# EAGLE schematic TK-BB-MD-07_vb (EAGLE 9.5.2)
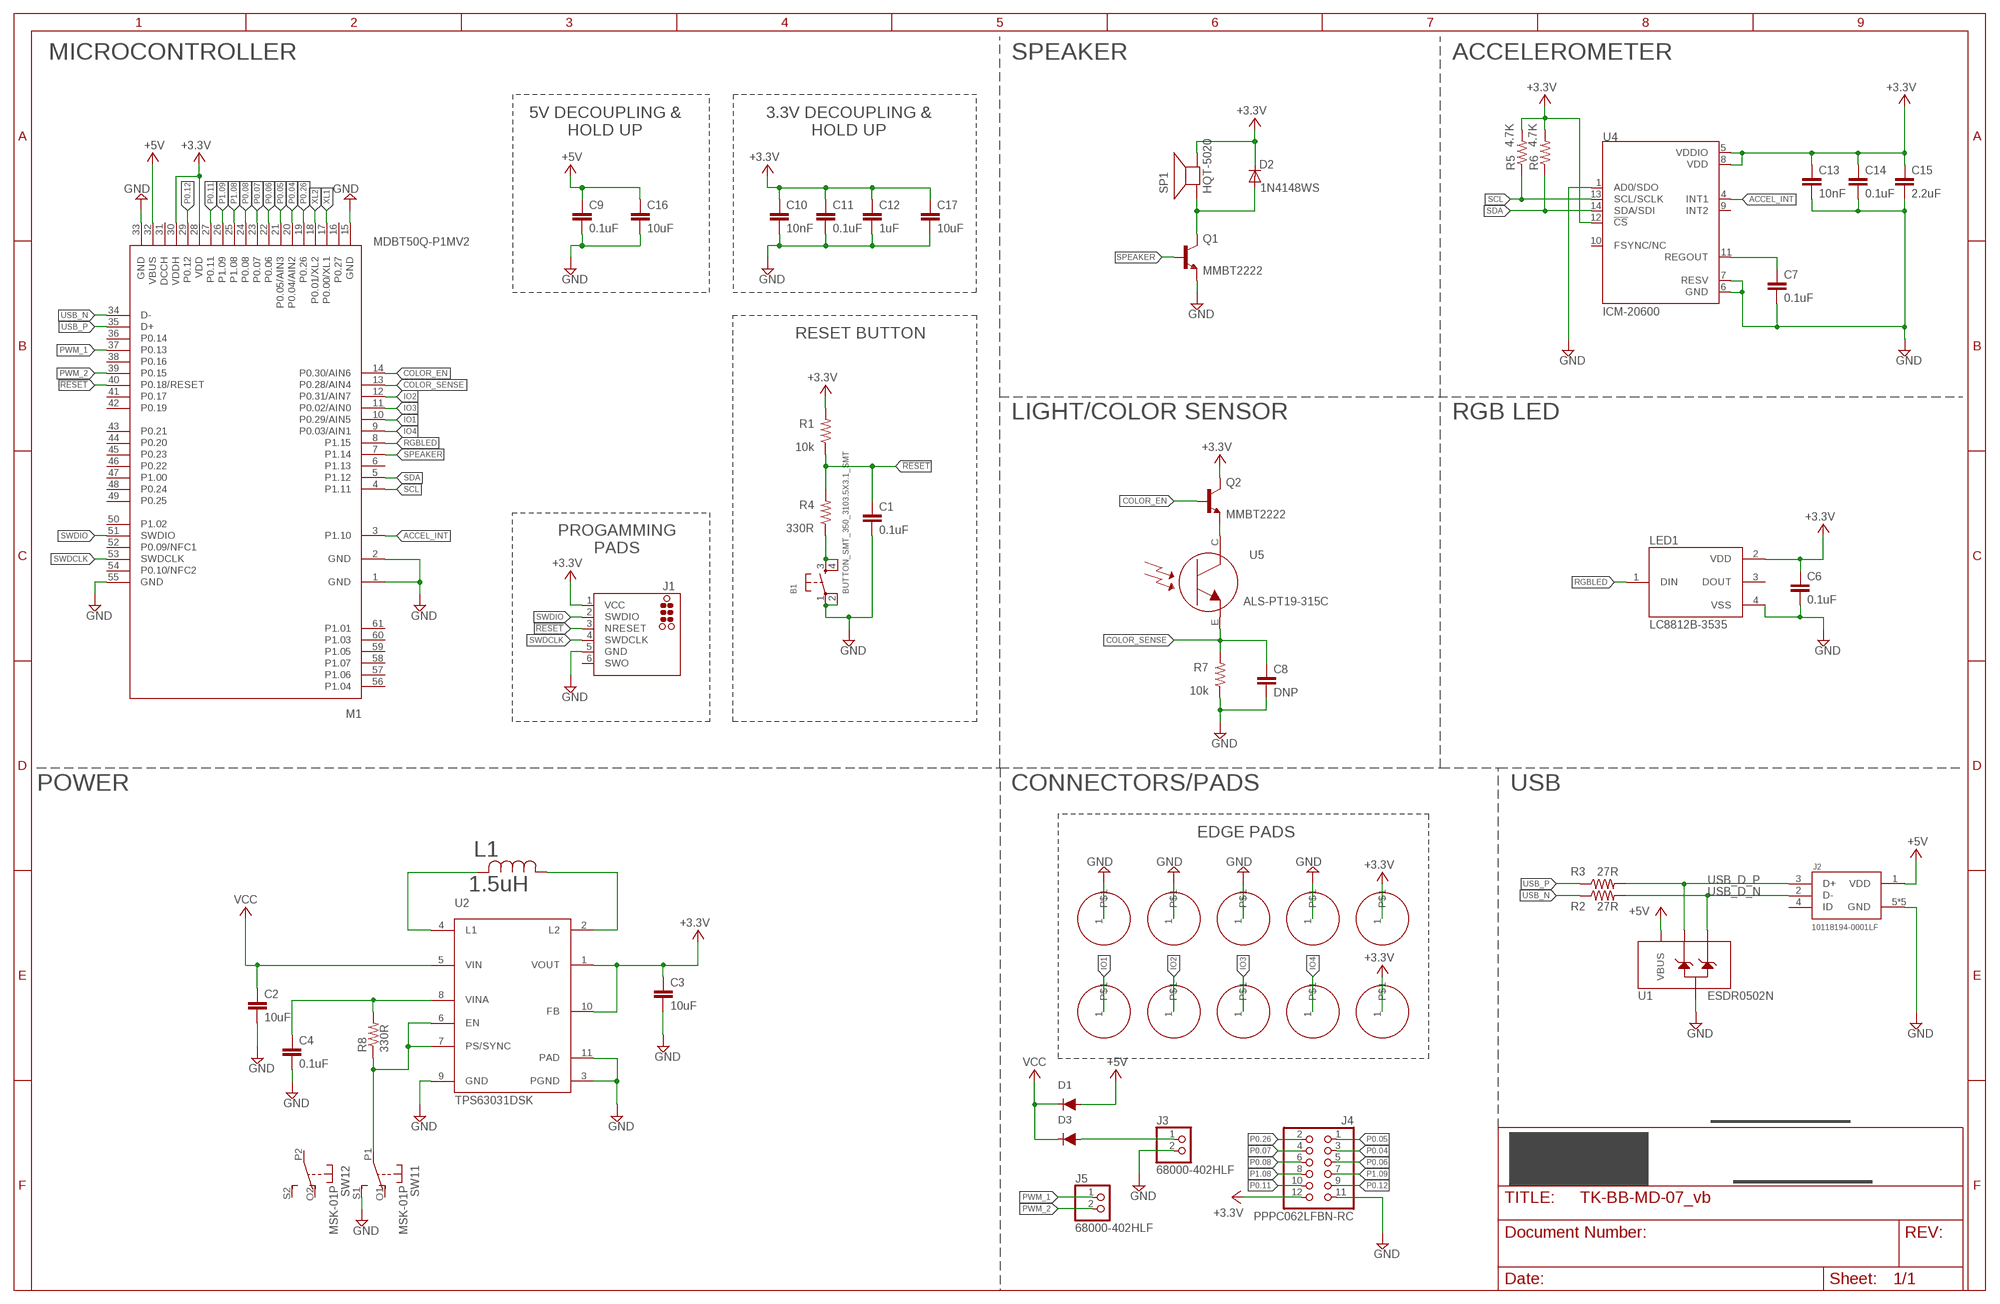
[diagram p0: schematic, sheet 1]

## Parts
B1  BUTTON_SMT_350_3103.5X3.1_SMT  [3.5X3.1_SMT]
C1  0.1uF  C_0.1UF_10V_0402  [0402]
C2  10uF  C_10UF_10V_0402  [0402]
C3  10uF  C_10UF_10V_0402  [0402]
C4  0.1uF  C_0.1UF_10V_0402  [0402]
C6  0.1uF  C_0.1UF_10V_0402  [0402]
C7  0.1uF  C_0.1UF_10V_0402  [0402]
C8  DNP  C_DNP_0402  [0402]
C9  0.1uF  C_0.1UF_10V_0402  [0402]
C10  10nF  C_10NF_10V_0402  [0402]
C11  0.1uF  C_0.1UF_10V_0402  [0402]
C12  1uF  C_1UF_10V_0402  [0402]
C13  10nF  C_10NF_10V_0402  [0402]
C14  0.1uF  C_0.1UF_10V_0402  [0402]
C15  2.2uF  C_2.2UF_10V_0402  [0402]
C16  10uF  C_10UF_10V_0402  [0402]
C17  10uF  C_10UF_10V_0402  [0402]
D1  NSR0320MW2T1G  DIODE_SCHOTTKY_NSR0320MW2T1G  [SOD323]
D2  1N4148WS  DIODE_1N148WSSOD-323  [SOD-323]
D3  NSR0320MW2T1G  DIODE_SCHOTTKY_NSR0320MW2T1G  [SOD323]
J1  DNP  TC2030-MCP-NL  [TC2030-MCP-NL]
J2  10118194-0001LF  [10118194-0001LF]
J3  68000-402HLF  PINHD-1X2  [1X02]
J4  PPPC062LFBN-RC  PINHD-2X6-F  [2X06-F]
J5  68000-402HLF  PINHD-1X2  [1X02]
L1  1.5uH  SDEM25201T-1R5MS  [INDC250X200X100]
LED1  LC8812B-3535  SK6812MINI_LC8812B-3535  [LC8812B-3535]
M1  MDBT50Q-P1MV2  [MDBT50]
P1  BB_PADS_BANANA_ROUND  [BB_PAD_BANANA]
P2  BB_PADS_BANANA_ROUND  [BB_PAD_BANANA]
P3  BB_PADS_BANANA_ROUND  [BB_PAD_BANANA]
P4  BB_PADS_BANANA_ROUND  [BB_PAD_BANANA]
P5  BB_PADS_BANANA_ROUND  [BB_PAD_BANANA]
P6  BB_PADS_BANANA_ROUND  [BB_PAD_BANANA]
P7  BB_PADS_BANANA_ROUND  [BB_PAD_BANANA]
P8  BB_PADS_BANANA_ROUND  [BB_PAD_BANANA]
P9  BB_PADS_BANANA_ROUND  [BB_PAD_BANANA]
P10  BB_PADS_BANANA_ROUND  [BB_PAD_BANANA]
Q1  MMBT2222  TRANSISTOR_NPN_MMBT2222_WIDE  [SOT23-WIDE]
Q2  MMBT2222  TRANSISTOR_NPN_MMBT2222_WIDE  [SOT23-WIDE]
R1  10k  R_10K_0.0625W_0402  [0402]
R2  27R  R_27R_0.0625W_0402  [0402]
R3  27R  R_27R_0.0625W_0402  [0402]
R4  330R  R_330R_0.0625W_0402  [0402]
R5  4.7K  R_4.7K_0.0625W_0402  [0402]
R6  4.7K  R_4.7K_0.0625W_0402  [0402]
R7  10k  R_10K_0.1W_0402  [0402]
R8  330R  R_330R_0.0625W_0402  [0402]
SP1  HQT-5020  SPEAKER_HQT-5020  [HQT-5020]
SW1  MSK-01P  DPDT_MSK-01P  [MSK-01P]
U1  ESDR0502N  [6-UFDFN]
U2  TPS63031DSK  TPS63031DSKT  [SON11P50_250X250X80]
U4  ICM-20600  [ICM-20600]
U5  ALS-PT19-315C  [ALS-PT19-315C]

## Nets
!RESET: C1.1 J1.3(NRESET) M1.40(P0.18/RESET) R1.1 R4.2
+3.3V: C3.1 C6.1 C10.1 C11.1 C12.1 C13.1 C14.1 C15.1 C17.1 D2.C J1.1(VCC) J4.12 LED1.2(VDD) M1.28(VDD) M1.30(VDDH) P9.1 P10.1 Q2.3(C) R1.2 R5.2 R6.2 SP1.- U2.1(VOUT) U2.10(FB) U4.5(VDDIO) U4.8(VDD) U4.12(!CS)
+3V3_IN_HDR: D3.2(A) J3.1
+5V: C9.1 C16.1 D1.2(A) J2.1(VDD) M1.32(VBUS) U1.P$6(VBUS)
ACCEL_INT: M1.3(P1.10) U4.4(INT1)
ACCEL_REGOUT: C7.1 U4.11(REGOUT)
ALS_C: Q2.2(E) U5.C
COLOR_EN: M1.14(P0.30/AIN6) Q2.1(B)
COLOR_SENSE: C8.1 M1.13(P0.28/AIN4) R7.2 U5.E
GND: B1.1(P) B1.2(P1) C1.2 C2.2 C3.2 C4.2 C6.2 C7.2 C8.2 C9.2 C10.2 C11.2 C12.2 C13.2 C14.2 C15.2 C16.2 C17.2 J1.5(GND) J2.5(GND) J2.P$6(GND) J2.P$7(GND) J2.P$8(GND) J2.P$9(GND) J3.2 J4.11 LED1.4(VSS) M1.1(GND) M1.2(GND) M1.15(GND) M1.33(GND) M1.55(GND) P1.1 P2.1 P3.1 P8.1 Q1.2(E) R7.1 SW1.S1(1:S) U1.P$1(GND) U2.3(PGND) U2.9(GND) U2.11(PAD) U4.1(AD0/SDO) U4.6(GND) U4.7(RESV)
IO1: M1.10(P0.29/AIN5) P6.1
IO2: M1.12(P0.31/AIN7) P4.1
IO3: M1.11(P0.02/AIN0) P7.1
IO4: M1.9(P0.03/AIN1) P5.1
N$1: L1.2 U2.4(L1)
N$2: B1.3(S) B1.4(S1) R4.1
N$3: L1.1 U2.2(L2)
N$4: R8.1 SW1.P1(1:P) U2.6(EN) U2.7(PS/SYNC)
N$6: C4.1 R8.2 U2.8(VINA)
P0.04: J4.3 M1.20(P0.04/AIN2)
P0.05: J4.1 M1.21(P0.05/AIN3)
P0.06: J4.5 M1.22(P0.06)
P0.07: J4.4 M1.23(P0.07)
P0.08: J4.6 M1.24(P0.08)
P0.11: J4.10 M1.27(P0.11)
P0.12: J4.9 M1.29(P0.12)
P0.26: J4.2 M1.19(P0.26)
P1.08: J4.8 M1.25(P1.08)
P1.09: J4.7 M1.26(P1.09)
PWM_1: J5.1 M1.37(P0.13)
PWM_2: J5.2 M1.39(P0.15)
Q1_C: D2.A Q1.3(C) SP1.+
RGBLED: LED1.1(DIN) M1.8(P1.15)
SCL: M1.4(P1.11) R5.1 U4.13(SCL/SCLK)
SDA: M1.5(P1.12) R6.1 U4.14(SDA/SDI)
SPEAKER: M1.7(P1.14) Q1.1(B)
SWDCLK: J1.4(SWDCLK) M1.53(SWDCLK)
SWDIO: J1.2(SWDIO) M1.51(SWDIO)
USB_D_N [USB]: J2.2(D-) R2.2 U1.P$3(D-) U1.P$4(D-)
USB_D_P [USB]: J2.3(D+) R3.2 U1.P$2(D+) U1.P$5(D+)
USB_N [USB]: M1.34(D-) R2.1
USB_P [USB]: M1.35(D+) R3.1
VCC: C2.1 D1.1(C) D3.1(C) U2.5(VIN)
XL1: M1.17(P0.00/XL1)
XL2: M1.18(P0.01/XL2)
Unconnected: J1.6(SWO) J2.4(ID) LED1.3(DOUT) M1.6(P1.13) M1.16(P0.27) M1.31(DCCH) M1.36(P0.14) M1.38(P0.16) M1.41(P0.17) M1.42(P0.19) M1.43(P0.21) M1.44(P0.20) M1.45(P0.23) M1.46(P0.22) M1.47(P1.00) M1.48(P0.24) M1.49(P0.25) M1.50(P1.02) M1.52(P0.09/NFC1) M1.54(P0.10/NFC2) M1.56(P1.04) M1.57(P1.06) M1.58(P1.07) M1.59(P1.05) M1.60(P1.03) M1.61(P1.01) SW1.O1(1:O) SW1.O2(2:O) SW1.P2(2:P) SW1.S2(2:S) U4.9(INT2) U4.10(FSYNC/NC)

## Notes on the sheet
- MICROCONTROLLER | SPEAKER | ACCELEROMETER
- 5V DECOUPLING &
  HOLD UP
- 3.3V DECOUPLING &
  HOLD UP
- RESET BUTTON
- LIGHT/COLOR SENSOR | RGB LED
- PROGAMMING
  PADS
- POWER | CONNECTORS/PADS | USB
- EDGE PADS

## Library data of the parts
B1 = teknikio-button:BUTTON_SMT_350_310
C1 C4 C6 C7 C9 C11 C14 = teknikio-passives:C: Standard SMD chip capacitors; DESCRIPTION: CAP CER 0.1UF 10V X7R 0402; MANUFACTURER: Yageo; MANUFACTURER_PART_NUMBER: CC0402KRX7R6BB104; SUPPLIER: Digi-Key; SUPPLIER_PART_NUMBER: 311-1345-1-ND
C2 C3 C16 C17 = teknikio-passives:C: Standard SMD chip capacitors; DESCRIPTION: CAP CER 10UF 10V X5R 0402; MANUFACTURER: Samsung; MANUFACTURER_PART_NUMBER: CL05A106MP8NUB8; SUPPLIER: Digi-Key; SUPPLIER_PART_NUMBER: 1276-6830-1-ND
C8 = teknikio-passives:C: Standard SMD chip capacitors; DESCRIPTION: 0402 CAP; MANUFACTURER: N/A; MANUFACTURER_PART_NUMBER: N/A; SUPPLIER: N/A; SUPPLIER_PART_NUMBER: N/A
C10 C13 = teknikio-passives:C: Standard SMD chip capacitors; DESCRIPTION: CAP CER 10000PF 10V X7R 0402; MANUFACTURER: Yageo; MANUFACTURER_PART_NUMBER: C0402C103K8RACTU; SUPPLIER: Digi-Key; SUPPLIER_PART_NUMBER: 399-7759-1-ND
C12 = teknikio-passives:C: Standard SMD chip capacitors; DESCRIPTION: CAP CER 1UF 10V X5R 0402; MANUFACTURER: Yageo; MANUFACTURER_PART_NUMBER: CC0402KRX5R6BB105; SUPPLIER: Digi-Key; SUPPLIER_PART_NUMBER: 311-1439-1-ND
C15 = teknikio-passives:C: Standard SMD chip capacitors; DESCRIPTION: CAP CER 2.2UF 10V X5R 0402; MANUFACTURER: Taiyo Yuden; MANUFACTURER_PART_NUMBER: LMK105BJ225MV-F; SUPPLIER: Digi-Key; SUPPLIER_PART_NUMBER: 587-3153-1-ND
D1 D3 = teknikio-passives:DIODE_SCHOTTKY; DESCRIPTION: DIODE SCHOTTKY 20V 1A SOD323; MANUFACTURER: ON Semiconductor; MANUFACTURER_PART_NUMBER: NSR0320MW2T1G; SUPPLIER: Digi-Key; SUPPLIER_PART_NUMBER: NSR0320MW2T1GOSCT-ND
D2 = teknikio-passives:DIODE: Diode SMA Model Volts Amps Type Vf Ir Digikey # Notes SSA34-E3 40V 3A Schottky 480mV @ 3A 200uA @ 40V SSA34-E3/61TGITR-ND CDBA120-G 20V 1A Schottky 500mV @ 1A 500uA @ 20V 641-1014-6-ND REEL MBRA210 10V 2A Schottky 350mV @ 2A 700uA @ 10V MBRA210LT3 SOD-123 Model Volts Amps Type Vf Ir Order # Notes BAT54T1G 30V 200mA Schottky 800mV @ 200mA 2uA @ 25V BAT54T1GOSTR-ND B0530W 30V 500mA Schottky 430mV @ 500mA 130uA @ 30V B0530W-FDICT-ND REEL MBR120 20V 1A Schottky 340mV @ 1A MBR120VLSFT1GOSCT-ND SOD-323 Model Volts Amps Type Vf Ir Order # Notes PMEG2005EJ 20V 500mA Schottky 355mV @ 500mA 568-4110-1-ND ZLLS410 10V 570mA Schottky 380mV @ 570mA ZLLS410CT-ND 1N4148WS 75V 150mA Silicon/Simple 1V 1N4148WSFSCT-ND REEL SOD-523 Model Volts Amps Type Vf Ir Order # Notes BAT54XV2 30V 200mA Schottky 0.8V @ 100mA BAT54XV2CT-ND TB751S 30V 30mA Schottky RB751S-40TE61CT-ND SOT23-R/W (R = Solder Paste/Reflow Ovens, W = Hand-Soldering) Model Volts Amps Type Vf Ir Order # Notes BAT54FILM 40V 300mA Schottky 497-7162-1-ND POWERDI-5 Model Volts Amps Type Vf Ir Order # Notes PDS560 60V 5A Schottky 670mV @ 5A 150uA @ 60V PDS560DICT-ND; DESCRIPTION: DIODE GEN PURP 75V 150MA SOD323F; MANUFACTURER: ON Semiconductor; MANUFACTURER_PART_NUMBER: 1N4148WS; SUPPLIER: Digi-Key; SUPPLIER_PART_NUMBER: 1N4148WSFSCT-ND
J1 = teknikio-conn:TC2030: TAG-CONNECT ICSP Connector Manufacturer: Tag-Connect <http://www.tag-connect.com> Cable for easy In-Circuit Serial Programming. Designed for Microchip ICD2, suitable for many others. Two variants - one "with legs" (for hands-free fit on PCB) and another "without legs" for quick programming. PAD Description 1 MCLR/Vpp 2 Vdd 3 GND 4 PGD (ISPDAT) 5 PGC (ISPCLK) 6 nc (used for LVP) ©2009 ROFA.cz - modified and updated by Robert Darlington ‹rdarlington@gmail.com›; DESCRIPTION: Tag-Connect ICSP Header - No Legs; MANUFACTURER: N/A; MANUFACTURER_PART_NUMBER: N/A; SUPPLIER: N/A; SUPPLIER_PART_NUMBER: N/A
J2 = teknikio-conn:10118194-0001LF: Conn Micro USB Type B RCP 5 POS 0.65mm Solder RA SMD 5 Terminal 1 Port T/R; DESCRIPTION: Conn Micro USB Type B RCP 5 POS 0.65mm Solder RA SMD 5 Terminal 1 Port T/R; MANUFACTURER: Amphenol; MANUFACTURER_PART_NUMBER: 10118194-0001LF; SUPPLIER: Digi-Key; SUPPLIER_PART_NUMBER: 609-4618-1-ND
J3 J5 = teknikio-conn:PINHD-1X2: PIN HEADER; DESCRIPTION: CONN HEADER VERT 2POS 2.54MM; MANUFACTURER: Amphenol; MANUFACTURER_PART_NUMBER: 68000-402HLF; SUPPLIER: Digi-Key; SUPPLIER_PART_NUMBER: 609-3503-ND
J4 = teknikio-conn:PINHD-2X6-F: PIN HEADER; DESCRIPTION: CONN HDR 12POS 0.1 GOLD PCB; MANUFACTURER: Sullins Connector Solutions; MANUFACTURER_PART_NUMBER: PPPC062LFBN-RC; SUPPLIER: Digi-Key; SUPPLIER_PART_NUMBER: S7109-ND
L1 = teknikio-passives:SDEM25201T-1R5MS; DESCRIPTION: FIXED IND 1.5UH 2.5A 100MOHM SMD; MANUFACTURER: Delta Electronics/Cyntec; MANUFACTURER_PART_NUMBER: SDEM25201T-1R5MS; SUPPLIER: Digi-Key; SUPPLIER_PART_NUMBER: 2037-SDEM25201T-1R5MSTR-ND
LED1 = teknikio-led:SK6812MINI: NeoPixel Mini 3535 RGB LEDs w/ Integrated Driver Chip - White; MPN: LC8812B-3535
M1 = teknikio-ic:MDBT50: Raytac Corporation MDBT50 Bluetooth Low Energy Module based on Noridc nRF52840 Source: Raytac datasheet; DESCRIPTION: nRF52840 BLE Module, PCB Antenna; MANUFACTURER: Raytac; MANUFACTURER_PART_NUMBER: MDBT50Q-P1MV2; SUPPLIER: Raytac; SUPPLIER_PART_NUMBER: MDBT50Q-P1MV2
P1-P10 = teknikio-pads:BB_PADS_BANANA; DESCRIPTION: Teknikio Thru-hole Pad; MANUFACTURER: N/A; MANUFACTURER_PART_NUMBER: N/A
Q1 Q2 = teknikio-ic:TRANSISTOR_NPN: NPN Transistor; DESCRIPTION: TRANS NPN 30V 0.6A SOT23; MANUFACTURER: ON Semiconductor; MANUFACTURER_PART_NUMBER: MMBT2222LT1G; SUPPLIER: Digi-Key; SUPPLIER_PART_NUMBER: MMBT2222LT1GOSCT-ND
R1 = teknikio-passives:R: Standard SMD chip resistors; DESCRIPTION: RES SMD 10K OHM 5% 1/16W 0402; MANUFACTURER: Yageo; MANUFACTURER_PART_NUMBER: RC0402JR-0710KL; SUPPLIER: Digi-Key; SUPPLIER_PART_NUMBER: 311-10KJRCT-ND
R2 R3 = teknikio-passives:R: Standard SMD chip resistors; DESCRIPTION: RES SMD 27 OHM 1% 1/16W 0402; MANUFACTURER: Yageo; MANUFACTURER_PART_NUMBER: AC0402FR-0727RL; SUPPLIER: Digi-Key; SUPPLIER_PART_NUMBER: YAG5278CT-ND
R4 R8 = teknikio-passives:R: Standard SMD chip resistors; DESCRIPTION: RES SMD 330 OHM 5% 1/16W 0402; MANUFACTURER: Yageo; MANUFACTURER_PART_NUMBER: RC0402JR-07330RL; SUPPLIER: Digi-Key; SUPPLIER_PART_NUMBER: 311-330JRCT-ND
R5 R6 = teknikio-passives:R: Standard SMD chip resistors; DESCRIPTION: RES SMD 4.7K OHM 5% 1/16W 0402; MANUFACTURER: Yageo; MANUFACTURER_PART_NUMBER: RC0402JR-074K7L; SUPPLIER: Digi-Key; SUPPLIER_PART_NUMBER: 311-4.7KJRCT-ND
R7 = teknikio-passives:R: Standard SMD chip resistors; DESCRIPTION: RES SMD 10K OHM 5% 1/10W 0402; MANUFACTURER: Panasonic; MANUFACTURER_PART_NUMBER: ERJ-2GEJ103X; SUPPLIER: Digi-Key; SUPPLIER_PART_NUMBER: P10KJCT-ND
SP1 = teknikio-speaker:SPEAKER: SPEAKER; DESCRIPTION: Speaker Piezo Buzzer 5mm; MANUFACTURER_PART_NUMBER: HQT-5020; SUPPLIER_PART_NUMBER: HQT-5020
SW1 = teknikio-switch:DPDT; DESCRIPTION: SWITCH SLIDE DPDT 300MA 6V; MANUFACTURER: Shenzen Gangyuan Microkey Technology; MANUFACTURER_PART_NUMBER: MSK-01P; SUPPLIER: Shenzen Gangyuan Microkey Technology; SUPPLIER_PART_NUMBER: MSK-01P
U1 = teknikio-ic:ESDR0502N; DESCRIPTION: TVS DIODE 5.5V 6UDFN; MANUFACTURER: ON Semiconductor; MANUFACTURER_PART_NUMBER: ESDR0502NMUTBG; SUPPLIER: Digi-Key; SUPPLIER_PART_NUMBER: ESDR0502NMUTBGOSCT-ND
U2 = teknikio-ic:TPS63031DSK; DESCRIPTION: IC REG BCK BST 3.3V 900MA 10SON; MANUFACTURER: Texas Instruments; MANUFACTURER_PART_NUMBER: TPS63031DSKR; SUPPLIER: Digi-key; SUPPLIER_PART_NUMBER: 296-39461-1-ND
U4 = teknikio-ic:ICM-20600: Low-Power, High-Performance Integrated 6-Axis MEMS MotionTracking Device in 2.5mm x 3mm Package; DESCRIPTION: Low-Power, High-Performance Integrated 6-Axis MEMS MotionTracking Device in 2.5mm x 3mm Package; MANUFACTURER: TDK-InvenSense; MANUFACTURER_PART_NUMBER: ICM-20600; SUPPLIER: Digi-Key; SUPPLIER_PART_NUMBER: 1428-1147-1-ND
U5 = teknikio-ic:ALS-PT19-315C: ALS-PT19-315C - Analog Light Sensor VCC: 2.5-5.5V; DESCRIPTION: SENSOR PHOTO 630NM 2SMD; MANUFACTURER: Everlight Electronics Co Ltd; MANUFACTURER_PART_NUMBER: ALS-PT19-315C/L177/TR8; SUPPLIER: Digi-Key; SUPPLIER_PART_NUMBER: 1080-1244-1-ND

## Net classes
1 USB: width 0.26 mm, clearance 0.125 mm